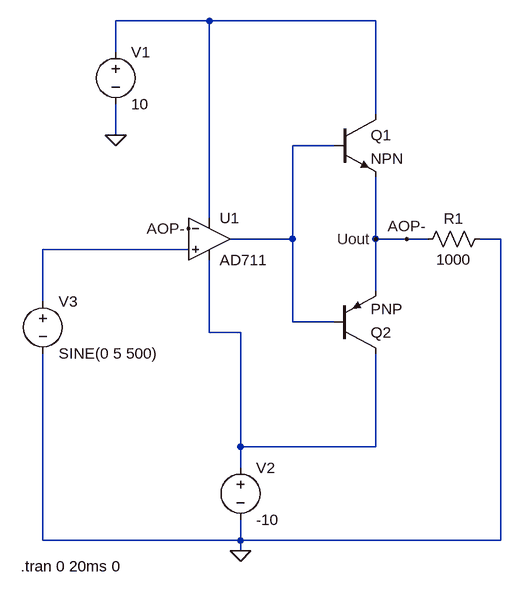
[diagram p0: schematic Draft1.asc]
Draft1.asc, the LTspice schematic file:
Version 4
SHEET 1 880 776
WIRE -80 -80 -224 -80
WIRE 176 -80 -80 -80
WIRE -224 -32 -224 -80
WIRE 176 64 176 -80
WIRE -224 96 -224 48
WIRE 112 112 48 112
WIRE -80 224 -80 -80
WIRE 48 256 48 112
WIRE 48 256 -48 256
WIRE 176 256 176 160
WIRE 224 256 176 256
WIRE 256 256 224 256
WIRE 368 256 336 256
WIRE -112 272 -336 272
WIRE 176 336 176 256
WIRE -336 352 -336 272
WIRE 48 384 48 256
WIRE 112 384 48 384
WIRE -80 400 -80 288
WIRE -32 400 -80 400
WIRE -32 576 -32 400
WIRE 176 576 176 432
WIRE 176 576 -32 576
WIRE -32 608 -32 576
WIRE -336 720 -336 432
WIRE -32 720 -32 688
WIRE -32 720 -336 720
WIRE 368 720 368 256
WIRE 368 720 -32 720
WIRE -32 736 -32 720
FLAG -112 240 AOP-
FLAG -32 736 0
FLAG -224 96 0
FLAG 176 256 Uout
FLAG 224 256 AOP-
SYMBOL npn 112 64 R0
SYMATTR InstName Q1
SYMBOL pnp 112 432 M180
SYMATTR InstName Q2
SYMBOL Opamps\\AD711 -80 192 R0
SYMATTR InstName U1
SYMBOL voltage -224 -48 R0
SYMATTR InstName V1
SYMATTR Value 10
SYMBOL voltage -32 592 R0
SYMATTR InstName V2
SYMATTR Value -10
SYMBOL voltage -336 336 R0
WINDOW 123 0 0 Left 0
WINDOW 39 0 0 Left 0
SYMATTR InstName V3
SYMATTR Value SINE(0 5 500)
SYMBOL res 352 240 R90
WINDOW 0 0 56 VBottom 2
WINDOW 3 32 56 VTop 2
SYMATTR InstName R1
SYMATTR Value 1000
TEXT -370 760 Left 2 !.tran 0 20ms 0

The netlist it stands for:
* Draft1.asc
Q1 N001 N002 Uout 0 NPN
Q2 N004 N002 Uout 0 PNP
XU1 N003 Uout N001 N004 N002 AD712  ; AD711, pins In+ In- V+ V- OUT
V1 N001 0 10
V2 N004 0 -10
V3 N003 0 SINE(0 5 500)
R1 0 Uout 1000
.model NPN NPN
.model PNP PNP
.lib standard.bjt
.tran 0 20ms 0
.lib ADI1.lib
.backanno
.end